# Altium project project.PrjPcb
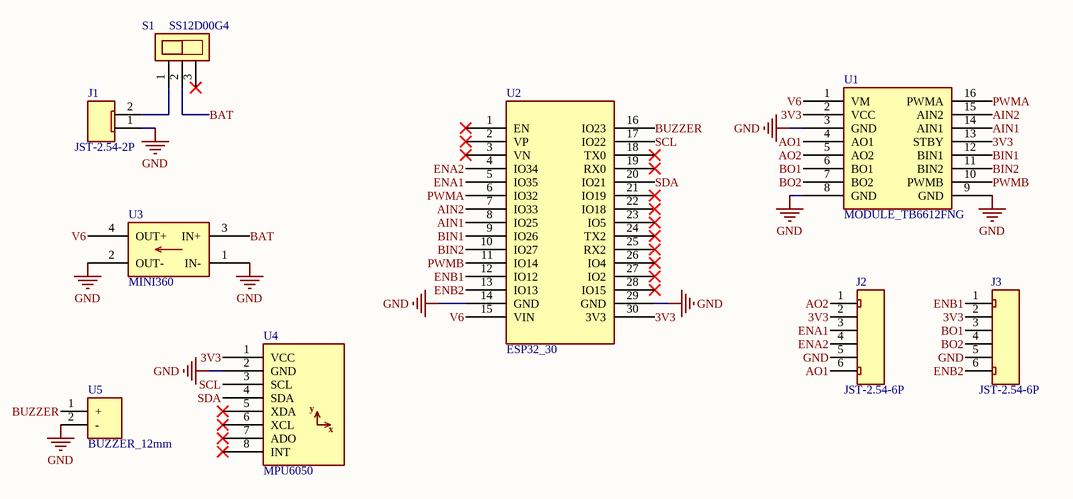
[diagram p0: schematic.SchDoc]
1 sheet, 9 parts. Net scope: global (net labels, ports and power ports of the same name join across sheets).
Board file: pcb.PcbDoc

## Sheet schematic.SchDoc
size A4; SheetNumber: 1; SheetTotal: 1

### Parts
J1  JST-2.54-2P  [JST-2.54-2P]
J2  JST-2.54-6P  [JST-2.54-6P]
J3  JST-2.54-6P  [JST-2.54-6P]
S1  SS12D00G4  [SS12D00G4]
U1  MODULE_TB6612FNG  [MODULE_TB6612FNG]
U2  ESP32_30  [ESP32_30]
U3  MINI360  [MINI360]
U4  MPU6050  [MPU6050]
U5  BUZZER_12mm  [BUZZER_12mm]

### Nets
GND: J1.1 J2.5 J3.5 U1.3(GND) U1.8(GND) U1.9(GND) U2.14(GND) U2.29(GND) U3.1(IN-) U3.2(OUT-) U4.2(GND) U5.2(-)
3V3: J2.2 J3.2 U1.2(VCC) U1.13(STBY) U2.30(3V3) U4.1(VCC)
AIN1: U1.14(AIN1) U2.8(IO25)
AIN2: U1.15(AIN2) U2.7(IO33)
AO1: J2.6 U1.4(AO1)
AO2: J2.1 U1.5(AO2)
BAT: S1.2 U3.3(IN+)
BIN1: U1.12(BIN1) U2.9(IO26)
BIN2: U1.11(BIN2) U2.10(IO27)
BO1: J3.3 U1.6(BO1)
BO2: J3.4 U1.7(BO2)
BUZZER: U2.16(IO23) U5.1(+)
ENA1: J2.3 U2.5(IO35)
ENA2: J2.4 U2.4(IO34)
ENB1: J3.1 U2.12(IO12)
ENB2: J3.6 U2.13(IO13)
PWMA: U1.16(PWMA) U2.6(IO32)
PWMB: U1.10(PWMB) U2.11(IO14)
SCL: U2.17(IO22) U4.3(SCL)
SDA: U2.20(IO21) U4.4(SDA)
V6: U1.1(VM) U2.15(VIN) U3.4(OUT+)
NetJ1_2: J1.2 S1.1

Not connected (* = marked no-connect by the designer): S1 3*; U2 1(EN)* 2(VP)* 3(VN)* 18(TX0)* 19(RX0)* 21(IO19)* 22(IO18)* 23(IO5)* 24(TX2)* 25(RX2)* 26(IO4)* 27(IO2)* 28(IO15)*; U4 5(XDA)* 6(XCL)* 7(ADO)* 8(INT)*

### Notes on the sheet
- (in symbol MPU6050) y; x

### Library data of the parts
J1 = JST-2.54-2P: Female Connector JST 2 Vias, 2.54mm.
J2 J3 = JST-2.54-6P: Female Connector JST 6 Vias, 2.54mm.
U1 = MODULE_TB6612FNG: Module Dual Motor Driver 2.5-13.5V 3.2A Peak 21x18mm; ComponentLink1Description: Datasheet; ComponentLink1URL: https://www.mouser.com/datasheet/2/408/TB6612FNG_datasheet_en_20141001-708260.pdf
U2 = ESP32_30: Microcontoller Board 30 Pins Wifi 2.4GHz BLE 4.2 ESP32-WROOM-32D; ComponentLink1Description: Datasheet; ComponentLink1URL: https://www.mouser.com/datasheet/2/891/esp32_wroom_32d_esp32_wroom_32u_datasheet_en-1365844.pdf
U3 = MINI360: MODULE BUCK STEP DOWN 3A 18x12mm; ComponentLink1Description: Datasheet; ComponentLink1URL: https://cdn-shop.adafruit.com/datasheets/MP2307_r1.9.pdf
U4 = MPU6050: IMU ACCEL/GYRO 3-AXIS I2C; ComponentLink1Description: Datasheet; ComponentLink1URL: https://invensense.tdk.com/wp-content/uploads/2015/02/MPU-6000-Datasheet1.pdf
U5 = BUZZER_12mm: BUZZER MAGNETIC 12MM; Digikey PN: 433-WT-1209T-ND; Mouser PN: 433-WT-1209T-ND